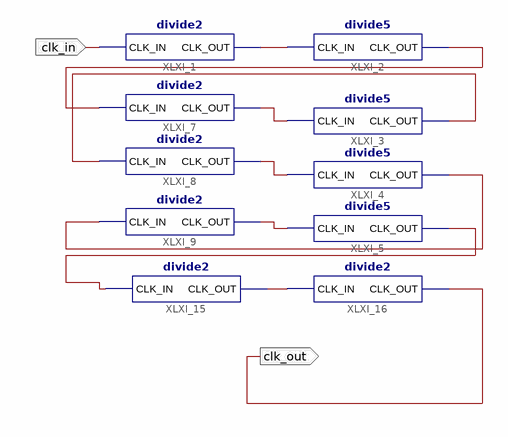
[diagram p0: schematic sheet 1]
// Xilinx ISE schematic divideTo500Hz.sch (spartan6) as structural Verilog: 10 symbols, 2 ports
module divideTo500Hz (
  input  clk_in,
  output clk_out
);

  wire XLXN_1, XLXN_2, XLXN_3, XLXN_4, XLXN_8, XLXN_9, XLXN_17, XLXN_20, XLXN_21;

  divide2 XLXI_1 (.CLK_IN(clk_in), .CLK_OUT(XLXN_1));
  divide5 XLXI_2 (.CLK_IN(XLXN_1), .CLK_OUT(XLXN_8));
  divide5 XLXI_3 (.CLK_IN(XLXN_2), .CLK_OUT(XLXN_9));
  divide5 XLXI_4 (.CLK_IN(XLXN_3), .CLK_OUT(XLXN_17));
  divide5 XLXI_5 (.CLK_IN(XLXN_4), .CLK_OUT(XLXN_20));
  divide2 XLXI_7 (.CLK_IN(XLXN_8), .CLK_OUT(XLXN_2));
  divide2 XLXI_8 (.CLK_IN(XLXN_9), .CLK_OUT(XLXN_3));
  divide2 XLXI_9 (.CLK_IN(XLXN_17), .CLK_OUT(XLXN_4));
  divide2 XLXI_15 (.CLK_IN(XLXN_20), .CLK_OUT(XLXN_21));
  divide2 XLXI_16 (.CLK_IN(XLXN_21), .CLK_OUT(clk_out));
endmodule
